# EasyEDA Pro project Glowbe-15panels.eprj

# Board PCB13_4
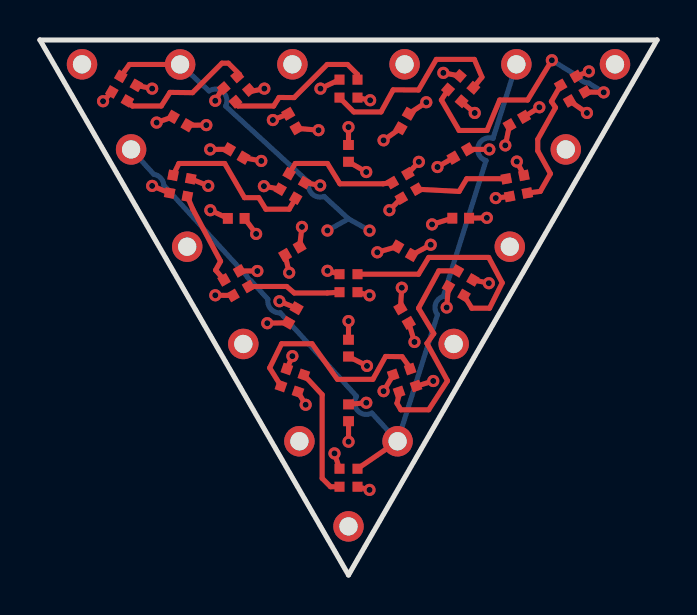
[diagram p0: board, top side]
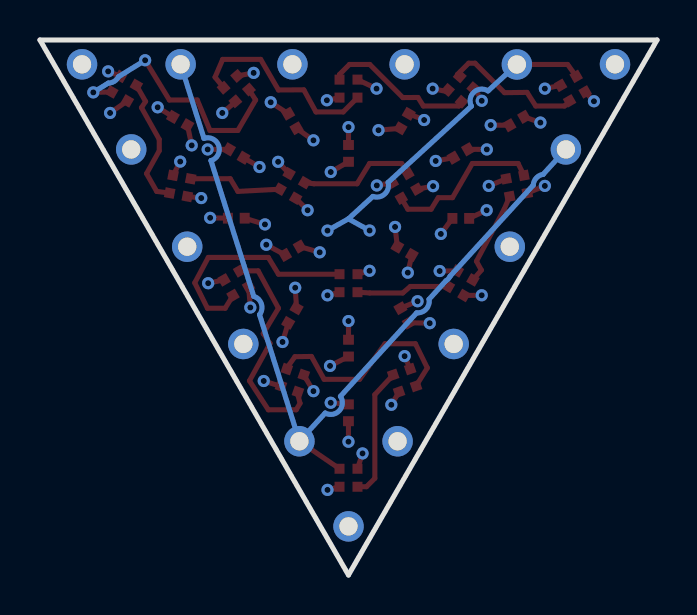
[diagram p1: board, bottom side, seen from below]

Outline 30.9 x 26.76 mm; copper layers: Top Layer, Inner1, Inner2, Bottom Layer. Coordinates in mm from the lower left corner of the outline.
Outline path: 0,26.76 15.45,0 30.9,26.76 0,26.76
Stack: Top Layer 0.035mm / Dielectric1 1.51mm FR4 er 4.5 / Inner1 0.035mm / Dielectric2 0.48mm PP er 4.5 / Inner2 0.035mm / Dielectric3 0.48mm PP er 4.5 / Bottom Layer 0.035mm

## Design rules (mm)
template: Custom Config
spacing copperThickness1oz (default): track to track 0.102, other pairs 0.152 to 0.3
spacing copperThickness2oz: track to track 0.203, other pairs 0.152 to 0.3
track width copperThickness1oz (default): min 0.127, default 0.254, max 2.54
track width copperThickness2oz: min 0.203, default 0.254, max 2.54
differential pair differentialPair (default): width min 0.127, default 0.254, max 2.54; gap min 0.152, default 0.152
via viaSize (default): diameter min 0.5, default 0.61, max 10; hole min 0.3, default 0.305, max 6.3
net VDD uses VCCGND
pour e1229 uses VCCGND

## Placement (name value [footprint] x y rotation side)
C1  100nF  [C0402]  7.02 22.71 330 top
C2  100nF  [C0402]  12.64 22.71 300 top
C3  100nF  [C0402]  18.26 22.71 60 top
C4  100nF  [C0402]  23.88 22.71 30 top
C5  100nF  [C0402]  9.83 21.08 330 top
C6  100nF  [C0402]  15.45 21.09 90 top
C7  100nF  [C0402]  21.07 21.08 30 top
C8  100nF  [C0402]  9.83 17.84 0 top
C9  100nF  [C0402]  21.07 17.85 0 top
C10  100nF  [C0402]  12.64 16.22 30 top
C11  100nF  [C0402]  18.26 16.22 330 top
C12  100nF  [C0402]  12.64 12.98 60 top
C13  100nF  [C0402]  18.26 12.98 300 top
C14  100nF  [C0402]  15.45 11.35 270 top
C15  100nF  [C0402]  15.45 8.11 270 top
LED1  SK6805-EC14  [LED-SMD_4P-L1.4-W1.4-TL]  4.21 24.33 60 top
LED2  SK6805-EC14  [LED-SMD_4P-L1.4-W1.4-TL#2]  26.69 24.33 300 top
LED3  SK6805-EC14  [LED-SMD_4P-L1.4-W1.4-TL#3]  15.45 4.87 180 top
LED4  SK6805-EC14  [LED-SMD_4P-L1.4-W1.4-TL#3]  15.45 24.33 0 top
LED5  SK6805-EC14  [LED-SMD_4P-L1.4-W1.4-TL]  21.07 14.6 240 top
LED6  SK6805-EC14  [LED-SMD_4P-L1.4-W1.4-TL#3]  9.83 14.6 120 top
LED7  SK6805-EC14  [LED-SMD_4P-L1.4-W1.4-TL#3]  9.83 24.31 41.1 top
LED9  SK6805-EC14  [LED-SMD_4P-L1.4-W1.4-TL#3]  23.88 19.46 280.9 top
LED11  SK6805-EC14  [LED-SMD_4P-L1.4-W1.4-TL#3]  12.64 9.73 160.9 top
LED12  SK6805-EC14  [LED-SMD_4P-L1.4-W1.4-TL#3]  7.02 19.46 79.1 top
LED13  SK6805-EC14  [LED-SMD_4P-L1.4-W1.4-TL]  12.64 19.46 60 top
LED14  SK6805-EC14  [LED-SMD_4P-L1.4-W1.4-TL#2]  18.26 19.46 300 top
LED15  SK6805-EC14  [LED-SMD_4P-L1.4-W1.4-TL#3]  15.45 14.6 180 top
LED16  SK6805-EC14  [LED-SMD_4P-L1.4-W1.4-TL#3]  21.07 24.33 319.1 top
LED17  SK6805-EC14  [LED-SMD_4P-L1.4-W1.4-TL#3]  18.26 9.73 199.1 top
NOREF  -  [Pad_e1147]  18.26 25.54 0 top
NOREF#2  -  [Pad_e1181]  7.37 16.42 0 top
NOREF#3  -  [Pad_e1149]  26.33 21.29 0 top
NOREF#4  -  [Pad_e1716]  15.45 2.43 0 top
NOREF#5  -  [Pad_e1180]  10.18 11.56 0 top
NOREF#6  -  [Pad_e1714]  28.79 25.54 0 top
NOREF#7  -  [Pad_e1148]  23.86 25.54 0 top
NOREF#8  -  [Pad_e1146]  12.64 25.54 0 top
NOREF#9  -  [Pad_e1172]  20.72 11.56 0 top
NOREF#10  -  [Pad_e1173]  17.91 6.69 0 top
NOREF#11  -  [Pad_e1153]  7.02 25.54 0 top
NOREF#12  -  [Pad_e1171]  23.53 16.42 0 top
NOREF#13  -  [Pad_e1717]  2.11 25.54 0 top
NOREF#14  -  [Pad_e1182]  4.56 21.29 0 top
NOREF#15  -  [Pad_e1174]  12.99 6.69 0 top

## Footprints (pads in the part's own frame, mm; a bottom-side part is the same pattern mirrored in y, then rotated)
C0402
  rect 0.5x0.54 smd: 1(-0.42,0) 2(0.42,0)
LED-SMD_4P-L1.4-W1.4-TL
  rect 0.5x0.5 smd: 1(-0.45,0.45) 2(-0.45,-0.45) 3(0.45,-0.45) 4(0.45,0.45)
LED-SMD_4P-L1.4-W1.4-TL#2
  rect 0.5x0.5 smd: 1(-0.45,0.45) 2(-0.45,-0.45) 3(0.45,-0.45) 4(0.45,0.45)
LED-SMD_4P-L1.4-W1.4-TL#3
  rect 0.5x0.5 smd: 1(-0.45,0.45) 2(-0.45,-0.45) 3(0.45,-0.45) 4(0.45,0.45)
Pad_e1146
  round 1.524 hole 0.914: 3(0,0)
Pad_e1147
  round 1.524 hole 0.914: 3(0,0)
Pad_e1148
  round 1.524 hole 0.914: 2(0,0)
Pad_e1149
  round 1.524 hole 0.914: 4(0,0)
Pad_e1153
  round 1.524 hole 0.914: 4(0,0)
Pad_e1171
  round 1.524 hole 0.914: 3(0,0)
Pad_e1172
  round 1.524 hole 0.914: 3(0,0)
Pad_e1173
  round 1.524 hole 0.914: 2(0,0)
Pad_e1174
  round 1.524 hole 0.914: 4(0,0)
Pad_e1180
  round 1.524 hole 0.914: 3(0,0)
Pad_e1181
  round 1.524 hole 0.914: 3(0,0)
Pad_e1182
  round 1.524 hole 0.914: 2(0,0)
Pad_e1714
  round 1.524 hole 0.914: 1(0,0)
Pad_e1716
  round 1.524 hole 0.914: 1(0,0)
Pad_e1717
  round 1.524 hole 0.914: 1(0,0)

## Nets
GND: C1.2 C2.2 C3.1 C4.1 C5.2 C6.1 C7.1 C8.2 C9.1 C10.2 C11.1 C12.2 C13.1 C14.1 C15.1 LED1.3 LED2.3 LED3.3 LED4.3 LED5.3 LED6.3 LED7.3 LED9.3 LED11.3 LED12.3 LED13.3 LED14.3 LED15.3 LED16.3 LED17.3 NOREF.3 NOREF#2.3 NOREF#5.3 NOREF#8.3 NOREF#9.3 NOREF#12.3
VDD: C1.1 C2.1 C3.2 C4.2 C5.1 C6.2 C7.2 C8.1 C9.2 C10.1 C11.2 C12.1 C13.2 C14.2 C15.2 LED1.1 LED2.1 LED3.1 LED4.1 LED5.1 LED6.1 LED7.1 LED9.1 LED11.1 LED12.1 LED13.1 LED14.1 LED15.1 LED16.1 LED17.1 NOREF#4.1 NOREF#6.1 NOREF#13.1
DI: LED1.4 NOREF#3.4 NOREF#11.4 NOREF#15.4
DO: LED3.2 NOREF#7.2 NOREF#10.2 NOREF#14.2

Pads without a net: LED1 2; LED2 2 4; LED3 4; LED4 2 4; LED5 2 4; LED6 2 4; LED7 2 4; LED9 2 4; LED11 2 4; LED12 2 4; LED13 2 4; LED14 2 4; LED15 2 4; LED16 2 4; LED17 2 4

## Via types
v1: diameter 0.61, hole 0.305, Top Layer to Bottom Layer, 64 vias

## Routing (per net, layer and track width the routed paths; a pad name or vN(x,y) marks a point on that pad's centre or on a via; arc(x,y) is an arc through that point)
GND: length 27.1
  Top Layer w0.254: v1(23.3,21.49) C4.1 ; v1(16.34,20.16) C6.1 ; v1(14.75,6.08) LED3.3 ; v1(13.95,22.25) C2.2 ; v1(13.12,17.41) C10.2 ; v1(22.82,18.85) LED9.3 ; v1(11.08,20.71) C5.2 ; LED4.3 v1(16.53,23.75) ; v1(19.91,20.41) C7.1 ; v1(18.12,14.37) C13.1 ; LED15.3 v1(14.4,15.22) ; v1(15.45,12.7) C14.1 ; 20.45,14.43 v1(20.37,13.38) ; v1(10.83,17.06) C8.2 ; 10,15.21 v1(10.89,15.2) ; v1(17.5,18.25) 18.09,18.85 ; v1(16.89,16.14) C11.1 ; LED1.3 v1(5.62,24.33) ; v1(11.99,13.69) C12.2 ; LED13.3 v1(14.03,19.49) ; 26.52,23.71 v1(27.39,23.11) ; v1(16.34,8.61) C15.1 ; v1(11.24,24.33) 10.45,24.16 ; v1(17.21,9.2) LED17.3 ; v1(17.21,21.74) 18.05,22.35 ; 21.23,23.56 v1(21.77,23.11) ; v1(8.33,22.5) C1.2 ; v1(19.63,17.54) C9.1 ; v1(12.64,10.95) 12.36,10.3 ; v1(8.43,19.46) LED12.3
VDD: length 26.5
  Top Layer w0.254: v1(18.75,11.66) C13.2 ; LED1.1 v1(3.16,23.7) ; v1(27.49,25.19) LED2.1 ; v1(12.48,15.12) C10.1 ; v1(20.2,25.11) LED16.1 ; v1(8.52,21.29) C5.1 ; C2.1 v1(11.66,22.76) ; v1(5.84,22.63) C1.1 ; v1(23.88,20.68) LED9.1 ; v1(22.38,17.86) C9.2 ; LED13.1 v1(11.21,19.45) ; v1(11.38,12.59) 12.43,12.62 ; v1(15.45,6.67) C15.2 ; v1(22.5,21.29) 21.43,21.29 ; LED4.1 v1(14.05,24.33) ; 9.67,13.98 v1(8.78,13.99) ; LED5.1 v1(22.48,14.59) ; v1(15.45,22.4) C6.2 ; v1(16.5,4.26) LED3.1 ; LED11.1 v1(13.31,8.52) ; v1(16.38,10.46) C14.2 ; v1(19.34,23.65) C3.2 ; v1(18.97,20.67) LED14.1 ; v1(5.62,19.46) LED12.1 ; v1(25.01,23.39) C4.2 ; LED15.1 v1(16.5,13.99) ; C8.1 v1(8.53,18.25) ; v1(19.57,16.52) C11.2 ; 9.22,24.49 v1(8.78,23.72) ; 18.87,9.45 v1(19.69,9.7)
(no net): length 113.6
  Top Layer w0.254: LED3.4 14.55,4.42 14.13,4.84 14.13,9.02 LED11.2 ; LED4.2 15.72,23.16 17.08,23.16 17.69,24.27 18.96,24.26 19.85,25.79 21.75,25.79 22.13,24.9 LED16.4 ; 20.43,24.28 20.1,23.76 20.99,22.23 22.39,22.23 23.02,23.76 24.42,23.76 v1(25.63,25.75) ; LED13.4 12.78,20.58 14.4,20.58 15.02,19.57 17.18,19.57 LED14.2 ; 20.9,15.21 19.97,15.21 18.96,13.34 19.72,12.07 19.38,11.58 20.41,9.72 19.47,8.26 18.07,8.26 17.88,8.59 18.02,9.15 ; LED6.4 8.8,15.25 9.04,15.69 7.65,18.3 LED12.2 ; LED14.4 20.99,19.19 21.37,19.82 LED9.2 ; 21.23,13.98 21.62,13.34 22.51,13.34 23.15,14.61 22.47,15.88 19.47,15.88 18.96,15.05 LED15.2 ; LED1.2 4.63,23.46 6.08,23.46 6.51,24.14 7.64,24.13 9.11,25.6 9.43,25.6 10,25.04 10,24.94 ; LED2.2 25.61,23.69 25.81,23.38 24.93,21.79 24.93,21.22 25.56,20.08 25.05,19.19 LED9.4 ; LED15.4 14.39,14.11 12.73,14.11 12.35,14.43 LED6.2 ; LED12.4 6.96,20.58 9.25,20.58 10.24,18.87 10.96,18.87 11.31,18.3 12.48,18.3 12.81,18.85 ; 9.67,23.71 9.92,23.46 11.7,23.46 11.97,23.89 12.73,23.88 14.39,25.54 15.4,25.54 15.9,25.04 LED4.4 ; LED11.4 11.5,10.36 12.1,11.57 13.62,11.57 14.89,9.79 16.67,9.79 17.31,10.93 18.13,10.92 18.58,10.3 ; v1(28.23,24.14) LED2.4
  Bottom Layer w0.254: v1(25.63,25.75) 26.97,24.92 arc(27.18,24.69) 27.48,24.61 v1(28.23,24.14)
DI: length 39.9
  Top Layer w0.254: LED1.4 4.48,25.54 NOREF#11.4
  Inner1 w0.254: v1(14.39,17.23) 14.2,15.77 arc(14.04,15.68) 13.91,15.54 arc(13.82,15.11) 14.06,14.74 13.31,9.1 arc(13.18,9.08) 13.05,9.04 arc(12.72,8.46) 13.16,7.95 NOREF#15.4
  Inner2 w0.254: v1(16.5,17.23) 17.57,17.67 arc(17.63,17.68) 17.69,17.7 arc(17.78,17.73) 17.86,17.79 23.61,20.16 arc(24.1,20.14) 24.43,20.5 NOREF#3.4
  Bottom Layer w0.254: NOREF#11.4 8.47,24.21 arc(9.17,24.15) 9.3,23.45 13.47,19.63 arc(13.64,19.05) 14.23,18.94 15.45,17.81 ; 15.45,17.81 v1(16.5,17.23) ; 15.45,17.81 v1(14.39,17.23)
DO: length 43.5
  Top Layer w0.254: LED3.2 NOREF#10.2
  Bottom Layer w0.254: NOREF#7.2 22.69,21.84 arc(21.95,21.47) 22.32,20.73 arc(22.33,20.73) 22.34,20.73 20.19,13.94 arc(19.81,13.56) 19.91,13.02 NOREF#10.2 16.62,8.1 arc(15.91,8.22) 15.85,8.94 12.04,13.11 arc(11.56,13.3) 11.42,13.79 10.58,14.71 arc(10.45,14.81) 10.36,14.94 6.2,19.5 arc(6.05,19.86) 5.7,20.04 NOREF#14.2

## Copper pours and planes (outline as drawn; the poured copper is in the pictures)
GND on Inner2: 0,26.76 15.45,0 30.9,26.76
GND on Inner2: 0,26.76 15.53,0.01 30.9,26.76
VDD on Inner1: 0,26.76 15.45,0 30.9,26.76
